# EAGLE design og1.0 (EAGLE 7.5.0)
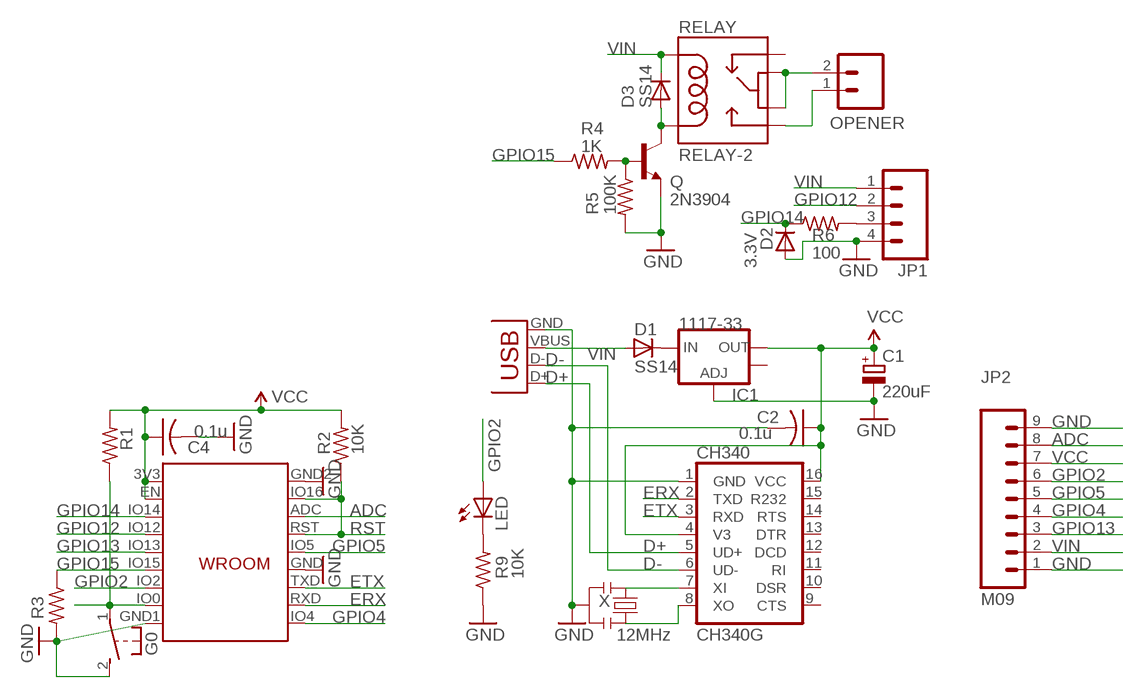
[diagram p0: schematic, sheet 1]

## Parts
C1  220uF  CPOL-EUCT3528  [CT3528]
C2  0.1u  C-USC0603K  [C0603K]
C4  0.1u  C-USC0603K  [C0603K]
CH340  CH340G  [SO16]
D1  SS14  DIODE-DO-214AC  [DO-214AC]
D2  3.3V  DIODE-MINIMELF  [MINIMELF]
D3  SS14  DIODE-DO-214AC  [DO-214AC]
ESP  WROOM02  [WROOM]
G0  31-XX  [B3F-31XX]
IC1  1117-33  V_REG_LM1117SOT223  [SOT223]
JP1  M04SONIC  [1X04_SONICSENSOR]
JP2  M09  [1X09]
LED  LEDLED3MM_ABBRV  [LED3MM_ABBRV]
OPENER  OPENER  M024MM-X  [SCREWTERMINAL-4MM-2-X]
Q  2N3904  TRANSISTOR_NPNSOT23-3  [SOT23-3]
R1  10K  R-US_R0603  [R0603]
R2  10K  R-US_R0603  [R0603]
R3  10K  R-US_R0603  [R0603]
R4  1K  R-US_R0603  [R0603]
R5  100K  R-US_R0603  [R0603]
R6  100  R-US_R0603  [R0603]
R9  10K  R-US_R0603  [R0603]
RELAY  RELAY-2  [RELAY-HK4100F]
X  12MHz  RESONATORSMD  [RESONATOR-SMD]
X3  USB-MICROB  [USB-MICROB]

## Nets
ADC: ESP.ADC JP2.8
D+: CH340.5(UD+) X3.D+
D-: CH340.6(UD-) X3.D-
ERX: CH340.2(TXD) ESP.RXD(RX)
ETX: CH340.3(RXD) ESP.TXD(TX)
GND: C1.- C2.2 C4.2 CH340.1(GND) D2.A ESP.GND ESP.GND1 ESP.GND2 G0.2(S) IC1.1(ADJ) JP1.4 JP2.1 JP2.9 Q.2(E) R3.2 R5.2 R9.1 X3.GND X.2
GPIO0: ESP.IO0 G0.1(P) R1.1
GPIO2: ESP.IO2 JP2.6 LED.A
GPIO4: ESP.IO4 JP2.4
GPIO5: ESP.IO5 JP2.5
GPIO12: ESP.IO12 JP1.2
GPIO13: ESP.IO13 JP2.3
GPIO14: D2.C ESP.IO14 R6.1
GPIO15: ESP.IO15 R3.1 R4.1
N$1: D1.C IC1.3(IN)
N$2: Q.1(B) R4.2 R5.1
N$3 [relaypower]: OPENER.2 RELAY.5 RELAY.6
N$4 [relaypower]: OPENER.1 RELAY.10
N$5: JP1.3 R6.2
N$7: LED.K(C) R9.2
N$11: CH340.7(XI) X.1
N$13: CH340.8(XO) X.3
N$32 [power]: D3.A Q.3(C) RELAY.9
RST: ESP.IO16 ESP.RST R2.1
VCC [power]: C1.+ C2.1 C4.1 CH340.4(V3) CH340.16(VCC) ESP.3V3(VCC) ESP.EN IC1.2(OUT) JP2.7 R1.2 R2.2
VIN [power]: D1.A D3.C JP1.1 JP2.2 RELAY.2 X3.VBUS
Unconnected: CH340.9(CTS) CH340.10(DSR) CH340.11(RI) CH340.12(DCD) CH340.13(DTR) CH340.14(RTS) CH340.15(R232) IC1.4(OUT) RELAY.1

## Library data of the parts
C1 = rcl:CPOL-EU: POLARIZED CAPACITOR, European symbol
C2 C4 = adafruit:C-US: CAPACITOR, American symbol
CH340 = SparkFunNew:CH340
D1-D3 = diode:DIODE-: DIODE
ESP = JeeParts:WROOM
G0 = adafruit:31-XX: OMRON SWITCH Now with beefier pads!
IC1 = SparkFun:V_REG_LM1117: Voltage Regulator LM1117 Standard adjustable voltage regulator but in SMD form. Spark Fun Electronics SKU : COM-00595
JP1 = SparkFun:M04: Header 4 Standard 4-pin 0.1" header. Use with straight break away headers (SKU : PRT-00116), right angle break away headers (PRT-00553), swiss pins (PRT-00743), machine pins (PRT-00117), and female headers (PRT-00115). Molex polarized connector foot print use with SKU : PRT-08231 with associated crimp pins and housings.
JP2 = SparkFun:M09: Header 9 Standard 9-pin 0.1" header. Use with straight break away headers (SKU : PRT-00116), right angle break away headers (PRT-00553), swiss pins (PRT-00743), machine pins (PRT-00117), and female headers (PRT-00115).
LED = adafruit:LED: LED OSRAM: - CHIPLED LG R971, LG N971, LY N971, LG Q971, LY Q971, LO R971, LY R971 LH N974, LH R974 LS Q976, LO Q976, LY Q976 LO Q996 - Hyper CHIPLED LW Q18S LB Q993, LB Q99A, LB R99A - SideLED LS A670, LO A670, LY A670, LG A670, LP A670 LB A673, LV A673, LT A673, LW A673 LH A674 LY A675 LS A676, LA A676, LO A676, LY A676, LW A676 LS A679, LY A679, LG A679 - Hyper Micro SIDELED® LS Y876, LA Y876, LO Y876, LY Y876 LT Y87S - SmartLED LW L88C, LW L88S LB L89C, LB L89S, LG L890 LS L89K, LO L89K, LY L89K LS L896, LA L896, LO L896, LY L896 - TOPLED LS T670, LO T670, LY T670, LG T670, LP T670 LSG T670, LSP T670, LSY T670, LOP T670, LYG T670 LG T671, LOG T671, LSG T671 LB T673, LV T673, LT T673, LW T673 LH T674 LS T676, LA T676, LO T676, LY T676, LB T676, LH T676, LSB T676, LW T676 LB T67C, LV T67C, LT T67C, LS T67K, LO T67K, LY T67K, LW E67C LS E67B, LA E67B, LO E67B, LY E67B, LB E67C, LV E67C, LT E67C LW T67C LS T679, LY T679, LG T679 LS T770, LO T770, LY T770, LG T770, LP T770 LB T773, LV T773, LT T773, LW T773 LH T774 LS E675, LA E675, LY E675, LS T675 LS T776, LA T776, LO T776, LY T776, LB T776 LHGB T686 LT T68C, LB T68C - Hyper Mini TOPLED® LB M676 - Mini TOPLED Santana® LG M470 LS M47K, LO M47K, LY M47K Source: http://www.osram.convergy.de/
OPENER = SparkFun:M02: Header 2 Standard 2-pin 0.1" header. Use with straight break away headers (SKU : PRT-00116), right angle break away headers (PRT-00553), swiss pins (PRT-00743), machine pins (PRT-00117), and female headers (PRT-00115). Molex polarized connector foot print use with SKU : PRT-08233 with associated crimp pins and housings.
Q = SparkFunNew:TRANSISTOR_NPN: Transistor NPN BJT configuration in SOT23 package. MMBT2222 is the common NPN we use. Double check BCE configuration again layout.
R1-R3 R9 = adafruit (picker 的冲突副本 2014-10-29):R-US_: RESISTOR, American symbol
R4-R6 = adafruit2013:R-US_: RESISTOR, American symbol
RELAY = SparkFunNew:RELAY-2
X = SparkFunNew:RESONATOR: Resonator Small SMD resonator. This is the itty bitty 10/20MHz resonators with built in caps. CSTCE10M0G55 and CSTCE20M0V53. Footprint has been reviewed closely but hasn't been tested yet.
X3 = SparkFunNew:USB: USB Connectors USB-B-PTH is fully proven SKU : PRT-00139 USB-miniB is fully proven SKU : PRT-00587 USB-A-PCB is untested. USB-A-H is throughly reviewed, but untested. Spark Fun Electronics SKU : PRT-00437 USB-B-SMT is throughly reviewed, but untested. Needs silkscreen touching up. USB-A-S has not been used/tested USB-MB-H has not been used/tested

## Net classes
0 default: width 0.178 mm, clearance 0.178 mm
1 power: width 0.305 mm, clearance 0.203 mm
2 relaypower: width 0.61 mm, clearance 0.457 mm

## Board
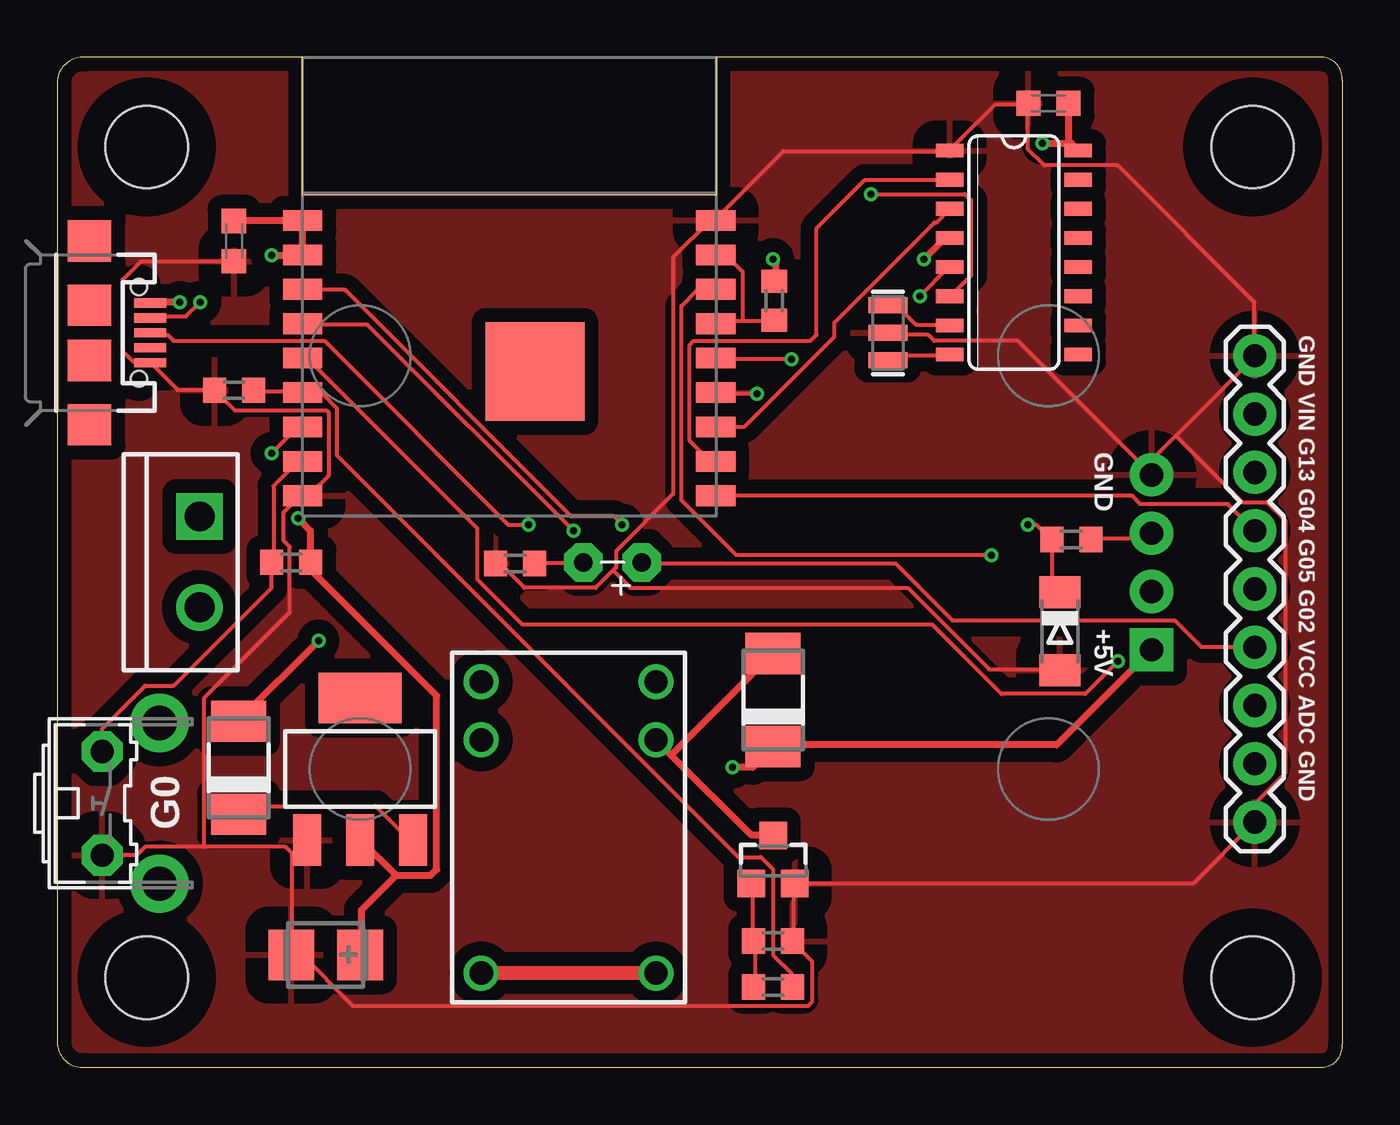
[diagram p1: board, top side]
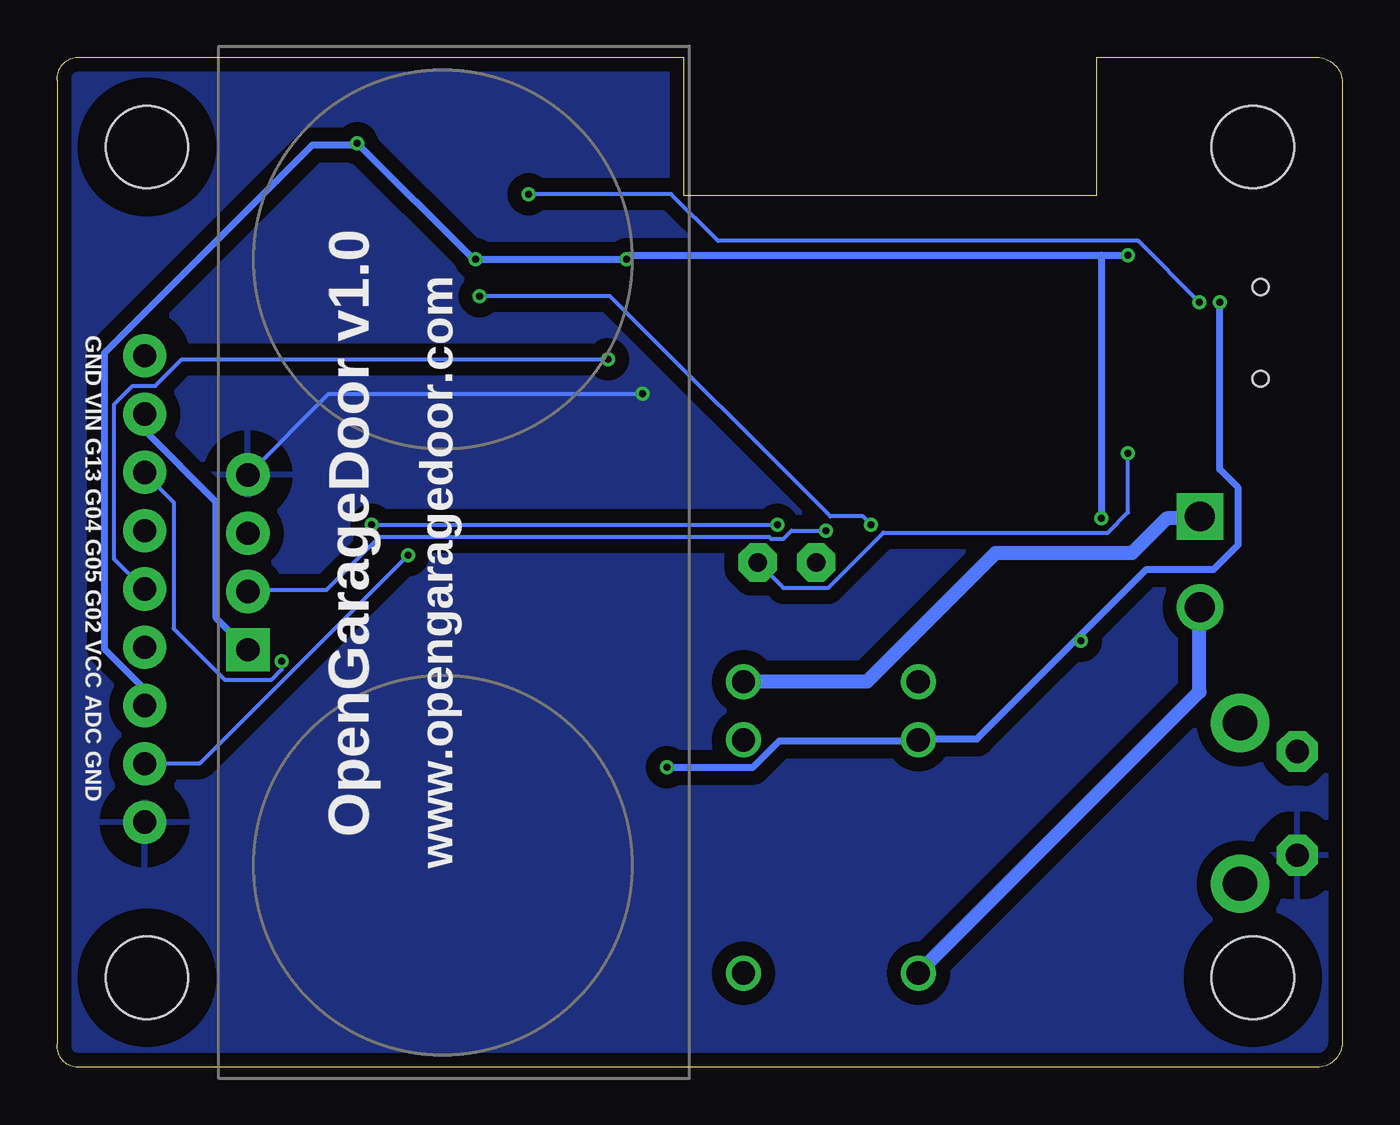
[diagram p2: board, bottom side, seen from below]

Size 56.01 x 44.01 mm. Coordinates in mm from the lower left corner, seen from the top.
Outline: 0,43 0,1 arc90 1.2,0 55.2,0 arc90 56,1 56,43 arc90 55.2,44 28.7,44 28.7,38 10.7,38 10.7,44 1.2,44 arc90 0,43
Copper layers (1*16): Top 0.035mm / dielectric 1.5mm / Bottom 0.035mm
Design rules "Fusion_eagle_rule_v1.1 *": minimum track width 6mil, minimum drill 12mil, track to track 6mil, track to pad 6mil, pad to pad 6mil, via to via 6mil, smd to smd 0mil, copper to edge 10mil, drill to drill 10mil, minimum pad ring 10mil, minimum via ring 6mil, stop-mask expansion 2mil, vias tented up to drill 100mil, thermal gap 40mil
Holes 3.6 mm at 3.9,3.9 52.1,3.9 3.9,40.1 52.1,40.1
tRestrict: area 1.5,37.7 to 6.3,42.5; area 1.5,1.5 to 6.3,6.3; area 49.7,37.7 to 54.5,42.5; area 49.7,1.5 to 54.5,6.3
bRestrict: area 1.5,37.7 to 6.3,42.5; area 1.5,1.5 to 6.3,6.3; area 49.7,1.5 to 54.5,6.3; area 49.7,37.7 to 54.5,42.5
vRestrict: area 10.8,24 to 28.6,38

### Footprints (pad centres in the part's own frame; a part is rotated, then mirrored left to right if it is on the bottom)
CT3528 = smd 2 x 2.2: + -1.5,0; - 1.5,0
C0603K = smd 1.05 x 1.08: 1 -0.875,0; 2 0.875,0
SO16 = smd 0.6 x 1.2: 1 -4.445,-2.8; 2 -3.175,-2.8; 3 -1.905,-2.8; 4 -0.635,-2.8; 5 0.635,-2.8; 6 1.905,-2.8; 7 3.175,-2.8; 8 4.445,-2.8; 9 4.445,2.8; 10 3.175,2.8; 11 1.905,2.8; 12 0.635,2.8; 13 -0.635,2.8; 14 -1.905,2.8; 15 -3.175,2.8; 16 -4.445,2.8
DO-214AC = smd 1.8 x 2.4: A 2.025,0; C -2.025,0
MINIMELF = smd 1.4 x 1.8: A 1.7,0; C -1.7,0
WROOM = smd 1.7 x 0.9: 3V3 -9,2.9; ADC 9,-0.1; EN -9,1.4; GND 9,-4.6; GND1 -9,-9.1; GND2 9,2.9; IO0 -9,-7.6; IO2 -9,-6.1; IO4 9,-9.1; IO5 9,-3.1; IO12 -9,-1.6; IO13 -9,-3.1; IO14 -9,-0.1; IO15 -9,-4.6; IO16 9,1.4; RST 9,-1.6; RXD 9,-7.6; TXD 9,-6.1 | smd 4.3 x 4.3: P$1 1.12,-3.68
B3F-31XX = drill 1.016 pad 1.778 octagon: 1 -2.261,-1.245; 2 2.261,-1.245 | drill 1.499 pad 2.54: 3 -3.505,1.245; 4 3.505,1.245
SOT223 = smd 1.219 x 2.235: 1 -2.311,-3.099; 2 0,-3.099; 3 2.311,-3.099 | smd 3.6 x 2.2: 4 0,3.099
1X04_SONICSENSOR = drill 1.016 pad 1.88 square: 1 -3.81,0 | drill 1.016 pad 1.88: 2 -1.27,0; 3 1.27,0; 4 3.81,0
1X09 = drill 1.016 pad 1.88: 1 0,0; 2 2.54,0; 3 5.08,0; 4 7.62,0; 5 10.16,0; 6 12.7,0; 7 15.24,0; 8 17.78,0; 9 20.32,0
LED3MM_ABBRV = drill 0.813 pad 1.676 octagon: A -1.27,0; K 1.27,0
SCREWTERMINAL-4MM-2-X = drill 1.3 pad 2.032 square: 1 0,0 | drill 1.3 pad 2.032: 2 3.96,0
SOT23-3 = smd 1.2 x 1.2: 1 -0.95,-1; 2 0.95,-1; 3 0,1.1
R0603 = smd 1 x 1.1: 1 -0.85,0; 2 0.85,0
RELAY-HK4100F = drill 1.016: 1 12.7,7.62; 2 10.16,7.62; 5 0,7.62; 6 0,0; 9 10.16,0; 10 12.7,0
RESONATOR-SMD = smd 0.7 x 1.7: 1 -1.2,0; 2 0,0; 3 1.2,0
USB-MICROB = smd 0.4 x 1.4: D+ 0,2.65; D- -0.65,2.65; GND 1.3,2.65; ID 0.65,2.65; VBUS -1.3,2.65 | smd 1.8 x 1.9: MT1 -4,0; MT2 4,0; MT3 1.2,0; MT4 -1.2,0 | hole 0.7: -2,2.15; 2,2.15

### Placement (x,y rotation side)
C1  11.7,4.9 180 top
C2  43.2,42 180 top
C4  7.7,36 270 top
CH340  41.7,35.5 270 top
D1  7.9,13.05 90 top
D2  43.7,19 270 top
D3  31.2,16 90 top
ESP  19.7,34 0 top
G0  3.2,11.5 270 top
IC1  13.2,13 0 top
JP1  47.7,22 90 top
JP2  52.2,31 270 top
LED  24.2,22 180 top
OPENER  6.2,24 270 top
Q  31.2,9 0 top
R1  10.2,22 0 top
R2  31.25,33.4 90 top
R3  7.7,29.5 180 top
R4  31.2,3.5 180 top
R5  31.2,5.5 0 top
R6  44.2,23 0 top
R9  19.95,21.95 0 top
RELAY  26.1,4.1 90 top
X  36.2,32 270 top
X3  1.4,32 270 top

### Tracks (layer width: path | path; a pad name or v marks a point on that pad's centre or on a via)
ADC  (via drill 0.3)
  Top 0.178: v40.72,22.32 29.6,22.32 27.2,24.72 27.2,33.16 27.91,33.88 28.63,33.88 ESP.ADC
  Bottom 0.178: v40.72,22.32 49.78,13.25 52.18,13.25 JP2.8
D+  (via drill 0.3)
  Top 0.178: v37.6,33.61 38.85,34.85 CH340.5 | v20.54,23.65 19.65,23.65 11.65,31.65 5.07,31.65 4.8,31.92 4.09,31.92 X3.D+
  Bottom 0.178: v37.6,33.61 31.91,33.61 22.31,24.01 20.89,24.01 v20.54,23.65
D-  (via drill 0.3)
  Top 0.178: v35.47,38.05 39.56,38.05 39.83,37.79 39.83,34.5 38.94,33.61 CH340.6 | v6.22,33.34 5.6,32.72 4.09,32.72 X3.D-
  Bottom 0.178: v35.47,38.05 29.25,38.05 27.2,36.01 8.89,36.01 v6.22,33.34
ERX
  Top 0.178: CH340.2 38.85,38.68 35.2,38.68 33.09,36.56 33.09,31.92 32.83,31.65 27.74,31.65 27.56,31.48 27.56,27.3 28.45,26.41 28.63,26.41 ESP.RXD
ETX
  Top 0.178: CH340.3 38.85,37.34 38.32,36.81 38.23,36.81 33.87,32.45 33.87,31.83 29.96,27.92 28.71,27.92 ESP.TXD
GND  (via drill 0.3)
  Top 0.178: 24.23,21.65 24.36,21.78 24.36,22.5 26.85,24.99 26.85,35.3 28.45,36.9 28.63,36.9 ESP.GND2 28.71,36.99 31.65,39.92 38.85,39.92 CH340.1 38.94,40.01 40.89,41.97 42.32,41.97 C2.2 42.32,41.88 42.32,40.01 43.03,39.3 46.23,39.3 52.18,33.34 52.18,31.03 JP2.1 52.18,30.94 48.76,27.52 | 24.23,21.65 23.47,20.9 20.36,20.9 19.38,21.87 19.11,21.87 R9.1 | 24.23,21.65 24.98,20.9 37.07,20.9 40.63,17.34 43.65,17.34 D2.A | 6.84,29.52 R3.2 | C4.2 7.64,35.12 3.65,35.12 2.85,34.32 2.85,31.21 3.29,30.76 4,30.76 X3.GND 4.09,30.68 5.25,29.52 6.76,29.52 R3.2 | R3.2 6.93,29.43 7.73,28.63 11.73,28.63 11.82,28.54 11.82,25.79 11.02,24.99 10.76,24.99 ESP.GND1 10.67,24.9 10.31,24.54 10.22,24.54 9.87,24.19 9.87,22.94 10.13,22.67 10.13,19.83 6.4,16.1 6.4,9.61 | 10.27,9.29 10.85,9.87 IC1.1 | 10.27,9.29 10.22,9.25 10.22,4.98 C1.- 10.31,4.98 10.58,4.98 12.89,2.67 32.72,2.67 32.89,2.85 32.89,4.63 32.09,5.43 R5.2 32.09,5.52 32.09,7.92 Q.2 32.18,8.01 49.52,8.01 52.18,10.67 JP2.9 52.27,10.76 52.27,11.56 53.52,12.81 53.52,23.83 52.72,24.63 51.65,24.63 48.76,27.52 | 6.4,9.61 9.96,9.61 10.27,9.29 | 6.4,9.61 3.82,9.61 3.47,9.25 G0.2 | v30.49,29.34 28.71,29.34 ESP.GND | 47.38,26.14 47.65,25.87 JP1.4 47.38,26.14 | 47.38,26.14 41.87,31.65 38.23,31.65 37.96,31.92 36.27,31.92 X.2 | 47.38,26.14 48.76,27.52
  Bottom 0.178: v30.49,29.34 44.18,29.34 47.65,25.87 JP1.4
  pour Top (isolate 0.61): 0,44 56,44 56,0 0,0
  pour Bottom (isolate 0.61): 0,44 56,44 56,0 0,0
GPIO0
  Top 0.178: ESP.IO0 10.67,26.32 10.4,26.32 9.42,25.34 9.42,22.05 R1.1 9.34,21.96 9.34,20.9 5.07,16.63 3.82,16.63 1.96,14.76 1.96,13.78 G0.1
GPIO2  (via drill 0.3)
  Top 0.178: v9.34,26.76 10.4,27.83 10.67,27.83 ESP.IO2 | JP2.6 52.18,18.32 49.87,18.32 48.72,19.47 39.03,19.47 36.54,21.96 25.51,21.96 LED.A
  Bottom 0.178: v9.34,26.76 9.34,24.19 10.22,23.3 20,23.3 22.4,20.9 24.36,20.9 25.43,21.96 LED.A
GPIO4
  Top 0.178: ESP.IO4 28.71,24.9 46.85,24.9 47.21,24.54 51.03,24.54 52.18,23.39 JP2.4
GPIO5  (via drill 0.3)
  Top 0.178: v32,30.85 28.71,30.85 ESP.IO5
  Bottom 0.178: v32,30.85 50.58,30.85 51.74,29.7 52.72,29.7 53.52,28.9 53.52,22.14 52.27,20.9 JP2.5
GPIO12  (via drill 0.3)
  Top 0.178: v22.49,23.39 13.51,32.36 10.76,32.36 ESP.IO12
  Bottom 0.178: v22.49,23.39 24,23.39 24.36,23.03 24.89,23.03 24.98,23.12 41.96,23.12 44.27,20.81 47.65,20.81 JP1.2
GPIO13  (via drill 0.3)
  Top 0.178: v46.23,17.7 44.81,16.27 41.16,16.27 38.14,19.3 20.27,19.3 18.31,21.25 18.31,23.47 10.94,30.85 10.76,30.85 ESP.IO13
  Bottom 0.178: v46.23,17.7 46.23,17.34 46.67,16.9 48.72,16.9 50.94,19.12 50.94,24.63 52.18,25.87 JP2.3
GPIO14  (via drill 0.3)
  Top 0.178: D2.C 43.65,20.72 43.38,20.98 43.38,22.94 R6.1 43.29,23.03 42.67,23.65 v42.32,23.65 | v24.62,23.65 24.27,24.01 22.4,24.01 12.54,33.88 10.76,33.88 ESP.IO14
  Bottom 0.178: v42.32,23.65 v24.62,23.65
GPIO15
  Top 0.178: R3.1 8.62,29.43 10.67,29.43 ESP.IO15 10.76,29.34 11.56,29.34 12.18,28.72 12.18,26.67 29.69,9.16 30.67,9.16 31.2,8.63 31.2,4.89 32,4.09 32,3.56 R4.1
N$1
  Top 0.178: IC1.3 15.47,9.96 15.29,9.96 13.87,11.38 8.18,11.38 7.91,11.12 D1.C
N$2
  Top 0.178: 30.4,3.47 R4.2 30.4,3.56 30.4,5.43 R5.1 30.32,5.52 30.32,7.92 Q.1
N$3
  Top 0.61: RELAY.5 26.05,4.09 RELAY.6
  Bottom 0.61: OPENER.2 6.22,20.01 6.22,16.36 18.4,4.18 RELAY.5
N$4
  Bottom 0.61: RELAY.10 26.05,16.81 20.71,16.81 15.11,22.41 9.16,22.41 7.64,23.92 6.22,23.92 OPENER.1
N$5
  Top 0.178: R6.2 45.07,23.03 47.47,23.03 47.65,23.21 JP1.3
N$7
  Top 0.178: R9.2 22.85,21.96 LED.K
N$11
  Top 0.178: CH340.7 38.85,32.36 37.43,32.36 36.63,33.16 36.27,33.16 X.1
N$13
  Top 0.178: CH340.8 38.85,31.03 36.45,31.03 36.27,30.85 X.3
N$32
  Top 0.305: 26.76,13.61 26.14,14.23 RELAY.9 | 26.76,13.61 30.23,10.14 31.11,10.14 Q.3 | 26.76,13.61 31.11,17.96 D3.A
RST
  Top 0.178: 29.87,32.54 28.8,32.54 28.71,32.45 ESP.RST | 29.87,32.54 31.2,32.54 R2.1 | 29.87,32.54 29.87,34.68 29.07,35.48 ESP.IO16
VCC  (via drill 0.3)
  Top 0.305: 14.76,8.36 16.27,8.36 16.54,8.63 16.54,16.18 11.11,21.61 11.11,21.96 R1.2 11.02,22.14 11.02,23.39 v10.49,23.92 | 14.76,8.36 13.25,9.87 IC1.2 | 14.76,8.36 13.25,6.85 13.25,4.98 C1.+ | 7.73,36.9 C4.1 7.82,36.9 10.67,36.9 ESP.3V3 10.67,36.81 10.67,35.48 ESP.EN 10.58,35.39 v9.34,35.39 | 44.09,40.37 44.09,41.97 C2.1 | 44.09,40.37 44.45,40.01 CH340.16 | v37.78,35.21 38.67,36.1 38.85,36.1 CH340.4 | v42.94,40.28 44.01,40.28 44.09,40.37 | R2.2 31.29,34.32 31.29,35.21 v31.2,35.21
  Bottom 0.305: 10.49,35.39 31.03,35.39 v31.2,35.21 v37.78,35.21 37.87,35.21 v42.94,40.28 43.03,40.19 44.9,40.19 53.96,31.12 53.96,18.23 52.27,16.54 52.27,15.83 JP2.7 | 10.49,35.39 v9.34,35.39 | 10.49,35.39 v10.49,23.92
VIN  (via drill 0.3)
  Top 0.305: v5.33,33.34 4.09,33.34 X3.VBUS | v11.38,18.58 7.91,15.12 D1.A | JP1.1 47.65,18.14 43.56,14.05 31.2,14.05 D3.C 31.11,13.87 30.32,13.07 v29.43,13.07
  Bottom 0.305: v5.33,33.34 5.33,26.05 4.53,25.25 4.53,22.76 5.6,21.7 8.53,21.7 11.47,18.76 | 11.47,18.76 15.91,14.32 18.4,14.32 RELAY.2 18.58,14.23 24.54,14.23 25.69,13.07 v29.43,13.07 | v11.38,18.58 11.38,18.67 11.47,18.76 | JP2.2 52.18,28.45 52.18,27.74 49.07,24.63 49.07,19.56 47.74,18.23 JP1.1

### Text on the board
tNames: GND VIN G13 G04 G05 G02 VCC ADC GND | GND | +5V
bNames: OpenGarageDoor v1.0 | www.opengaragedoor.com | GND VIN G13 G04 G05 G02 VCC ADC GND